# Altium schematic sheet P-MOS DMP3013SFV-7.SchDoc
size A4
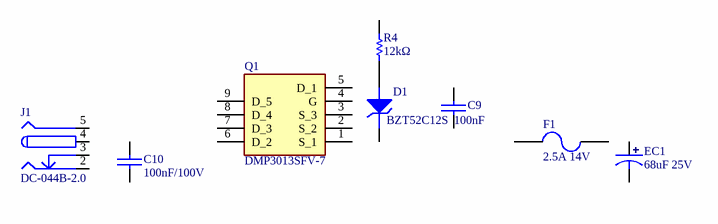
[diagram p0: P-MOS DMP3013SFV-7.SchDoc]

## Parts
C9  100nF  [C_0402]
C10  100nF/100V  [C_0603]
D1  BZT52C12S  [SOD-323]
EC1  68uF 25V  [SMD-EC6.3X6.3X10]
F1  2.5A 14V  [Fuse_1812]
J1  DC-044B-2.0  [DC-044B]
Q1  DMP3013SFV-7  [DMP3013SFV7]
R4  12kΩ  [R_0402]

## Nets
NetD1_A: D1.A R4.2

Not connected (* = marked no-connect by the designer): C9 1 2; C10 1 2; D1 K; EC1 1 2; F1 1 2; J1 2 3 4 5; Q1 1(S_1) 2(S_2) 3(S_3) 4(G) 5(D_1) 6(D_2) 7(D_3) 8(D_4) 9(D_5); R4 1

## Library data of the parts
C9 C10 = Cap_Chip: 贴片电容; Manufacturer_Name: *; Manufacturer_Part_Number: *
D1 = Diode_Zener: 稳压二极管; Manufacturer_Name: YONGYUTAI(永裕泰); Manufacturer_Part_Number: BZT52C12S; LCSC: C2891797
EC1 = Cap_E_SMD: 贴片电解电容; Manufacturer_Name: lelon(台湾立隆); Manufacturer_Part_Number: VZH680M1ETR-0606; LCSC: C249947
F1 = FUSE_PTC: 自恢复贴片保险丝; Manufacturer_Name: TLC(竞沃); Manufacturer_Part_Number: TLC-MSMD250/14; LCSC: C381482
J1 = DC-044B: DC电源座子; Manufacturer_Name: XKB Connectivity(中国星坤); Manufacturer_Part_Number: DC-044B-3A-2.0
Q1 = DMP3013SFV-7: MOSFET (P-Channel); Manufacturer_Name: Diodes Inc.; Manufacturer_Name_1: ALLPOWER(铨力); Manufacturer_Part_Number_1: AP15P03Q; Manufacturer_Part_Number: DMP3013SFV-7; LCSC: C264098,C461071
R4 = Res_Chip: 贴片电阻; Manufacturer_Name: *; Manufacturer_Part_Number: *